# Altium schematic sheet DC_Power_Regulation - Copy.SchDoc: STM32F446 CNC
size B; Author: AM; CompanyName: Expatria Technologies; DrawnBy: A.Marles; Engineer: AM; Organization: Expatria Technolgoies; Address1: 1136 Glade Court; Address3: Port Coquitlam, BC V3B 1R5; Address4: Canada; DocumentNumber: 15; SheetNumber: 23; SheetTotal: 29
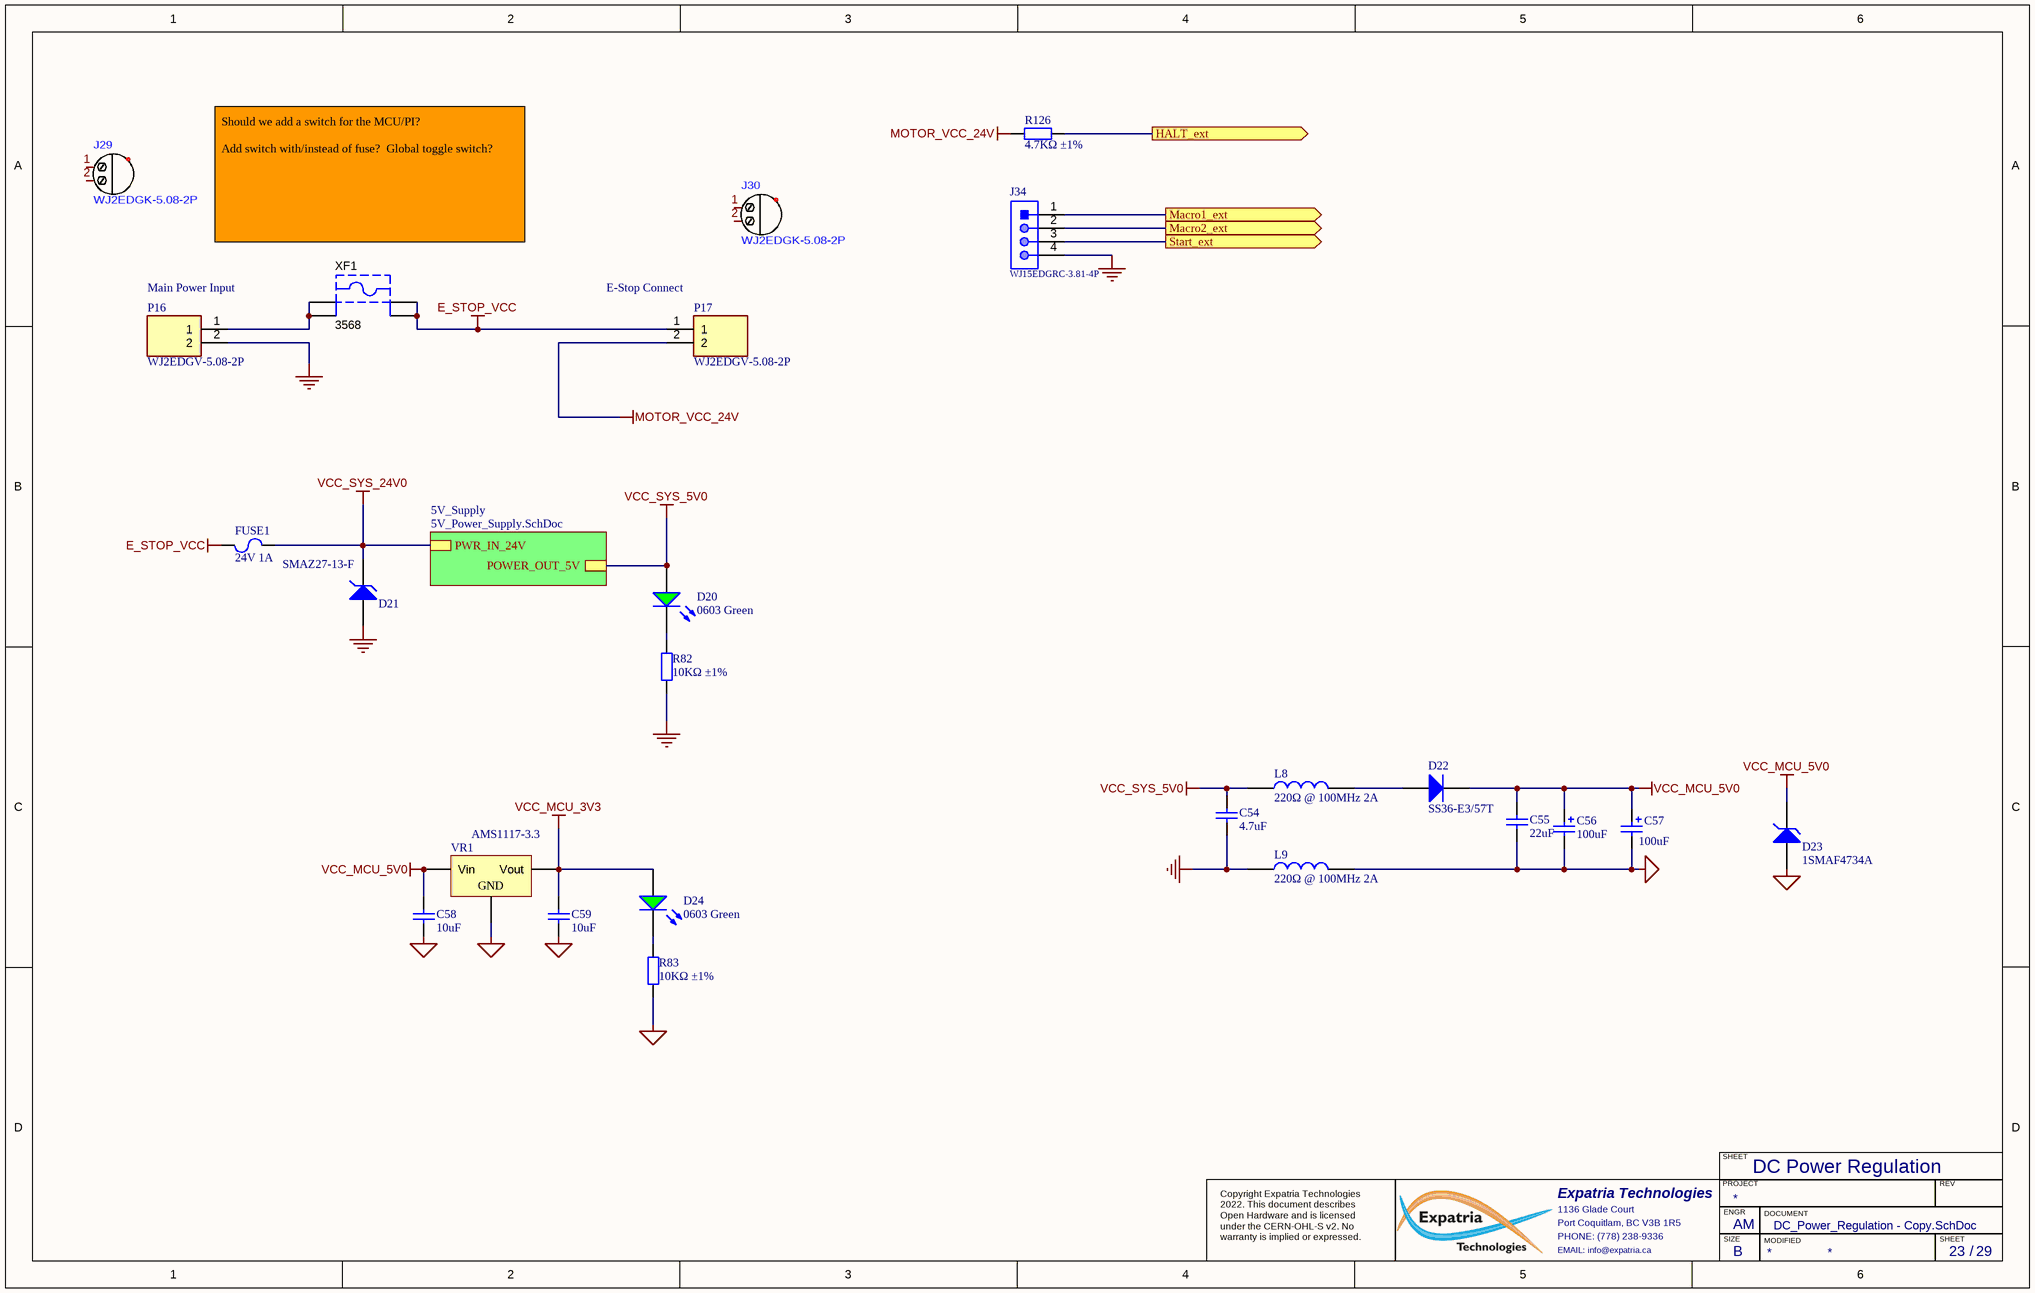
[diagram p0: DC_Power_Regulation - Copy.SchDoc]

## Parts
C54  4.7uF  [0603_C]
C55  22uF  [0805_C]
C56  100uF  [CASE-B_3528]
C57  100uF  [WCAP-ASLI_D6.3H7.7]
C58  10uF  [1206_C]
C59  10uF  [1206_C]
D20  0603 Green  [0603_LED_S1]
D21  SMAZ27-13-F  [DIOM5226X240N]
D22  SS36-E3/57T  [SMC(DO-214AB)_S1]
D23  1SMAF4734A  [DIOM5226X240N]
D24  0603 Green  [0603_LED_S1]
FUSE1  24V 1A  [1206_C]
J29  WJ2EDGK-5.08-2P  (mechanical)
J30  WJ2EDGK-5.08-2P  (mechanical)
J34  WJ15EDGRC-3.81-4P  [SHDRRA4W85P0X381_1X4_1612X915X720P]
L8  220Ω @ 100MHz 2A  [0805_C]
L9  220Ω @ 100MHz 2A  [0805_C]
P16  WJ2EDGV-5.08-2P  [WJ2EDGV5082P]
P17  WJ2EDGV-5.08-2P  [WJ2EDGV5082P]
R82  10KΩ ±1%  [0603_R]
R83  10KΩ ±1%  [0603_R]
R126  4.7KΩ ±1%  [0603_R]
VR1  AMS1117-3.3  [SOT-223]
XF1  3568  [KSTN-3568_V]

## Sub-sheets
5V_Supply = 5V_Power_Supply.SchDoc: POWER_OUT_5V, PWR_IN_24V

## Ports
HALT_ext (out), Macro1_ext (out), Macro2_ext (out), Start_ext (out)

## Nets
E_STOP_VCC: FUSE1.1 P17.1 XF1.3 XF1.4
GND: C54.1 D21.1(A) J34.4 L9.1 P16.2 R82.1
MCU_GND: C55.1 C56.2 C57.2(N) C58.1 C59.1 D23.1(A) L9.2 R83.1 VR1.1(GND)
MOTOR_VCC_24V: P17.2 R126.2
VCC_MCU_3V3: C59.2 D24.A VR1.2(Vout)
VCC_MCU_5V0: C55.2 C56.1 C57.1(P) C58.2 D22.2(K) D23.2(K) VR1.3(Vin)
VCC_SYS_5V0: C54.2 D20.A L8.1 ; sheet 5V_Supply/POWER_OUT_5V
VCC_SYS_24V0: D21.2(K) FUSE1.2 ; sheet 5V_Supply/PWR_IN_24V
HALT_ext: R126.1 ; port HALT_ext
Macro1_ext: J34.1 ; port Macro1_ext
Macro2_ext: J34.2 ; port Macro2_ext
Start_ext: J34.3 ; port Start_ext
NetD20_K: D20.K R82.2
NetD22_1: D22.1(A) L8.2
NetD24_K: D24.K R83.2
NetP16_1: P16.1 XF1.1 XF1.2

Not connected (* = marked no-connect by the designer): J29 1 2; J30 1 2

## Notes on the sheet
- Should we add a switch for the MCU/PI?
  Add switch with/instead of fuse?  Global toggle switch?
- (near P16) Main Power Input
- (near P17) E-Stop Connect
- DC Power Regulation
- SHEET
- Expatria Technologies
- 1136 Glade Court
- Port Coquitlam, BC V3B 1R5
- PHONE: (778) 238-9336
- PROJECT
- SIZE
- ENGR
- MODIFIED
- DOCUMENT
- REV
- Copyright Expatria Technologies 2022. This document describes Open Hardware and is licensed under the CERN-OHL-S v2. No warranty is implied or expressed.
- EMAIL: info@expatria.ca
- B
- /

## Library data of the parts
C54 = 0603 4.7uF (475) 10% 16V: Chip capacitors; Manufacturer: Samsung Electro-Mechanics; PartNumber: CL10A475KO8NNNC; Tolerance: 10%; Voltage: 16V; ComponentLink1Description: Supplier link; ComponentLink1URL: http://www.szlcsc.com/product/details_20375.html; Package: 0603; Supplier: LCSC; SuppliersPartNumber: C19666; Capacitance: 4.7uF
C55 = 0805 22uF (226) 20% 25V: Chip capacitors; Manufacturer: Samsung Electro-Mechanics; PartNumber: CL21A226MAQNNNE; Tolerance: 20%; Voltage: 25V; ComponentLink1Description: Supplier link; ComponentLink1URL: http://www.szlcsc.com/product/details_46786.html; Package: 0805; Supplier: LCSC; SuppliersPartNumber: C45783; Capacitance: 22uF
C56 = 3528 100uF (107) 10% 6.3V: Tantalum capacitor; Manufacturer: AVX; PartNumber: TAJB107K006RNJ; Tolerance: 10%; Voltage: 6.3V; ComponentLink1Description: Supplier link; ComponentLink1URL: http://www.szlcsc.com/product/details_16815.html; Package: 3528; Supplier: LCSC; SuppliersPartNumber: C16133; Capacitance: 100uF
C57 = 865080445010: -45℃~+105℃ 2000hrs@105℃ 100uF 7.7mm 35V 6.3mm ±20% SMD,6.3x7.7mm Aluminum Electrolytic Capacitors - SMD ROHS; Manufacturer: Capxon International Elec; SuppliersPartNumber: C59934; Value: 100uF; Supplier: LCSC
C58 C59 = 1206 10uF (106) 10% 50V: Chip capacitors; Manufacturer: Samsung Electro-Mechanics; PartNumber: CL31A106KBHNNNE; Tolerance: 10%; Voltage: 50V; ComponentLink1Description: Supplier link; ComponentLink1URL: http://www.szlcsc.com/product/details_14236.html; Package: 1206; Supplier: LCSC; SuppliersPartNumber: C13585; Capacitance: 10uF; Manufacturer 1: Samsung Electro-Mechanics
D20 D24 = 0603 LED Green: LED; ComponentLink1Description: 供应商链接; ComponentLink1URL: http://www.szlcsc.com/product/details_73152.html; Package: 0603; Supplier: LCSC; SuppliersPartNumber: C72043; Color: Green
D21 D23 = BZT52C27: 27V ±5% 1W 500nA @ 20.5V SMA(DO-214AC) Zener Diodes RoHS; ComponentLink1Description: 供应商链接; ComponentLink1URL: http://www.szlcsc.com/product/details_8541.html; Supplier: LCSC
  D21: Package: SMA(DO-214AC); SuppliersPartNumber: C155318
  D23: Package: SMAF; SuppliersPartNumber: C169539
D22 = SMC(DO-214AB) SS36-E3/57T: DIODE SCHOTTKY 60V 3A DO214AB; ComponentLink1Description: 供应商链接; ComponentLink1URL: http://www.szlcsc.com/product/details_36698.html; Package: SMC(DO-214AB); Supplier: LCSC; SuppliersPartNumber: C35722
FUSE1 = JK-nSMD050-24: 24V 1A 0.1s 1206 PTC Resettable Fuses RoHS; Manufacturer: Jinrui Electronic Materials Co.; Package: 1206; Supplier: LCSC; SuppliersPartNumber: C369160; PartNumber: JK-nSMD050-24
J29 J30 = WJ2EDGK-5.08-2P: 5.08mm Green Plug P=5.08mm Pluggable System Terminal Block ROHS; Manufacturer: Kangnex; Supplier: LCSC; Supplier Part Number 1: C71370; Manufacturer Part Number: WJ2EDGK-5.08-2P; RoHS: No; SuppliersPartNumber: C71370
J34 = WJ15EDGRC-3.81-4P: 3.81mm Green Board Edge/Receptacle-Close Push-Pull,P=3.81mm Pluggable System Terminal Block ROHS; Manufacturer: Ningbo Kangnex Elec; SuppliersPartNumber: C7245; Supplier Part Number 1: C7245; Supplier 1: LCSC; Manufacturer Part Number: WJ15EDGRC-3.81-4P; RoHS: Yes; Category: Terminals
L8 = 0402 220R@100Mhz 0.1A: 220Ω @ 100MHz 2A 150mΩ 0805 Ferrite Beads ROHS; Notepad: *; Package: 0805; Supplier: LCSC; SuppliersPartNumber: C139188
L9 = 0402 220R@100Mhz 0.1A: 220Ω @ 100MHz 1 2A 150mΩ 0805 Ferrite Beads ROHS; Notepad: *; Package: 0805; Supplier: LCSC; SuppliersPartNumber: C139188
P16 P17 = WJ2EDGV-5.08-2P: 5.08mm Green Board Edge/Receptacle-Open Straight,P=5.08mm Pluggable System Terminal Block ROHS; Manufacturer_Name: Ningbo Kangnex; Manufacturer: Kangnex; SuppliersPartNumber: C8461; Datasheet Link: https://datasheet.lcsc.com/szlcsc/1912251635_Ningbo-Kangnex-Elec-WJ2EDGV-5-08-2P_C8461.pdf; Height: 12.4mm; Manufacturer_Part_Number: WJ2EDGV-5.08-2P; Supplier 1: LCSC; Supplier Part Number 1: C8461; Manufacturer Part Number: WJ2EDGV-5.08-2P; RoHS: No
R82 R83 = 0603 10K (1002) 1%: Chip resistor; Manufacturer: Uniroyal Elec; PartNumber: 0603WAF1002T5E; Power: 1/10W; ComponentLink1Description: Supplier link; ComponentLink1URL: http://www.szlcsc.com/product/details_26547.html; Package: 0603; Supplier: LCSC; SuppliersPartNumber: C25804; Resistance: 10KΩ; Tolerance: 1%
R126 = 0603 4.7K (4701) 1%: Chip resistor; Manufacturer: Uniroyal Elec; PartNumber: 0603WAF4701T5E; Power: 1/10W; ComponentLink1Description: Supplier link; ComponentLink1URL: http://www.szlcsc.com/product/details_23889.html; Package: 0603; Supplier: LC; SuppliersPartNumber: C23162; Resistance: 4.7KΩ; Tolerance: 1%
VR1 = SOT-223 AMS1117-3.3: Vout=3.3V 1A 72dB@(120Hz) (LDO); Manufacturer 1: AMS; ComponentLink1Description: 供应商链接; ComponentLink1URL: http://www.szlcsc.com/product/details_6652.html; Package: SOT-223; Supplier: LCSC; SuppliersPartNumber: C6186; Manufacturer Part Number 1: AMS1117-3.3; Manufacturer: AMS; Manufacturer Part Number: AMS1117-3.3
XF1 = 3568-20: Fuse Holder, 20 A, 500 V, -50 to 145 degC, 4-Pin THD, RoHS; Manufacturer: Keystone Electronics; Package Reference: 3568; Datasheet Version: 04/2013; Datasheet URL: https://datasheet.ciiva.com/16294/m60-2p40-16294706.pdf; Manufacturer URL: http://www.keyelco.com/; Mounting Technology: ThroughHole; Package Description: 4-Pin Through Hole Device, Body 16 x 6.73 mm, Pitch 9.9 mm; SuppliersPartNumber: C3206956; Supplier: LCSC; Manufacturer Part Number: 3568-20